# EAGLE design Backplane-2 (EAGLE 7.4.0)

## Sheet 1 of 2
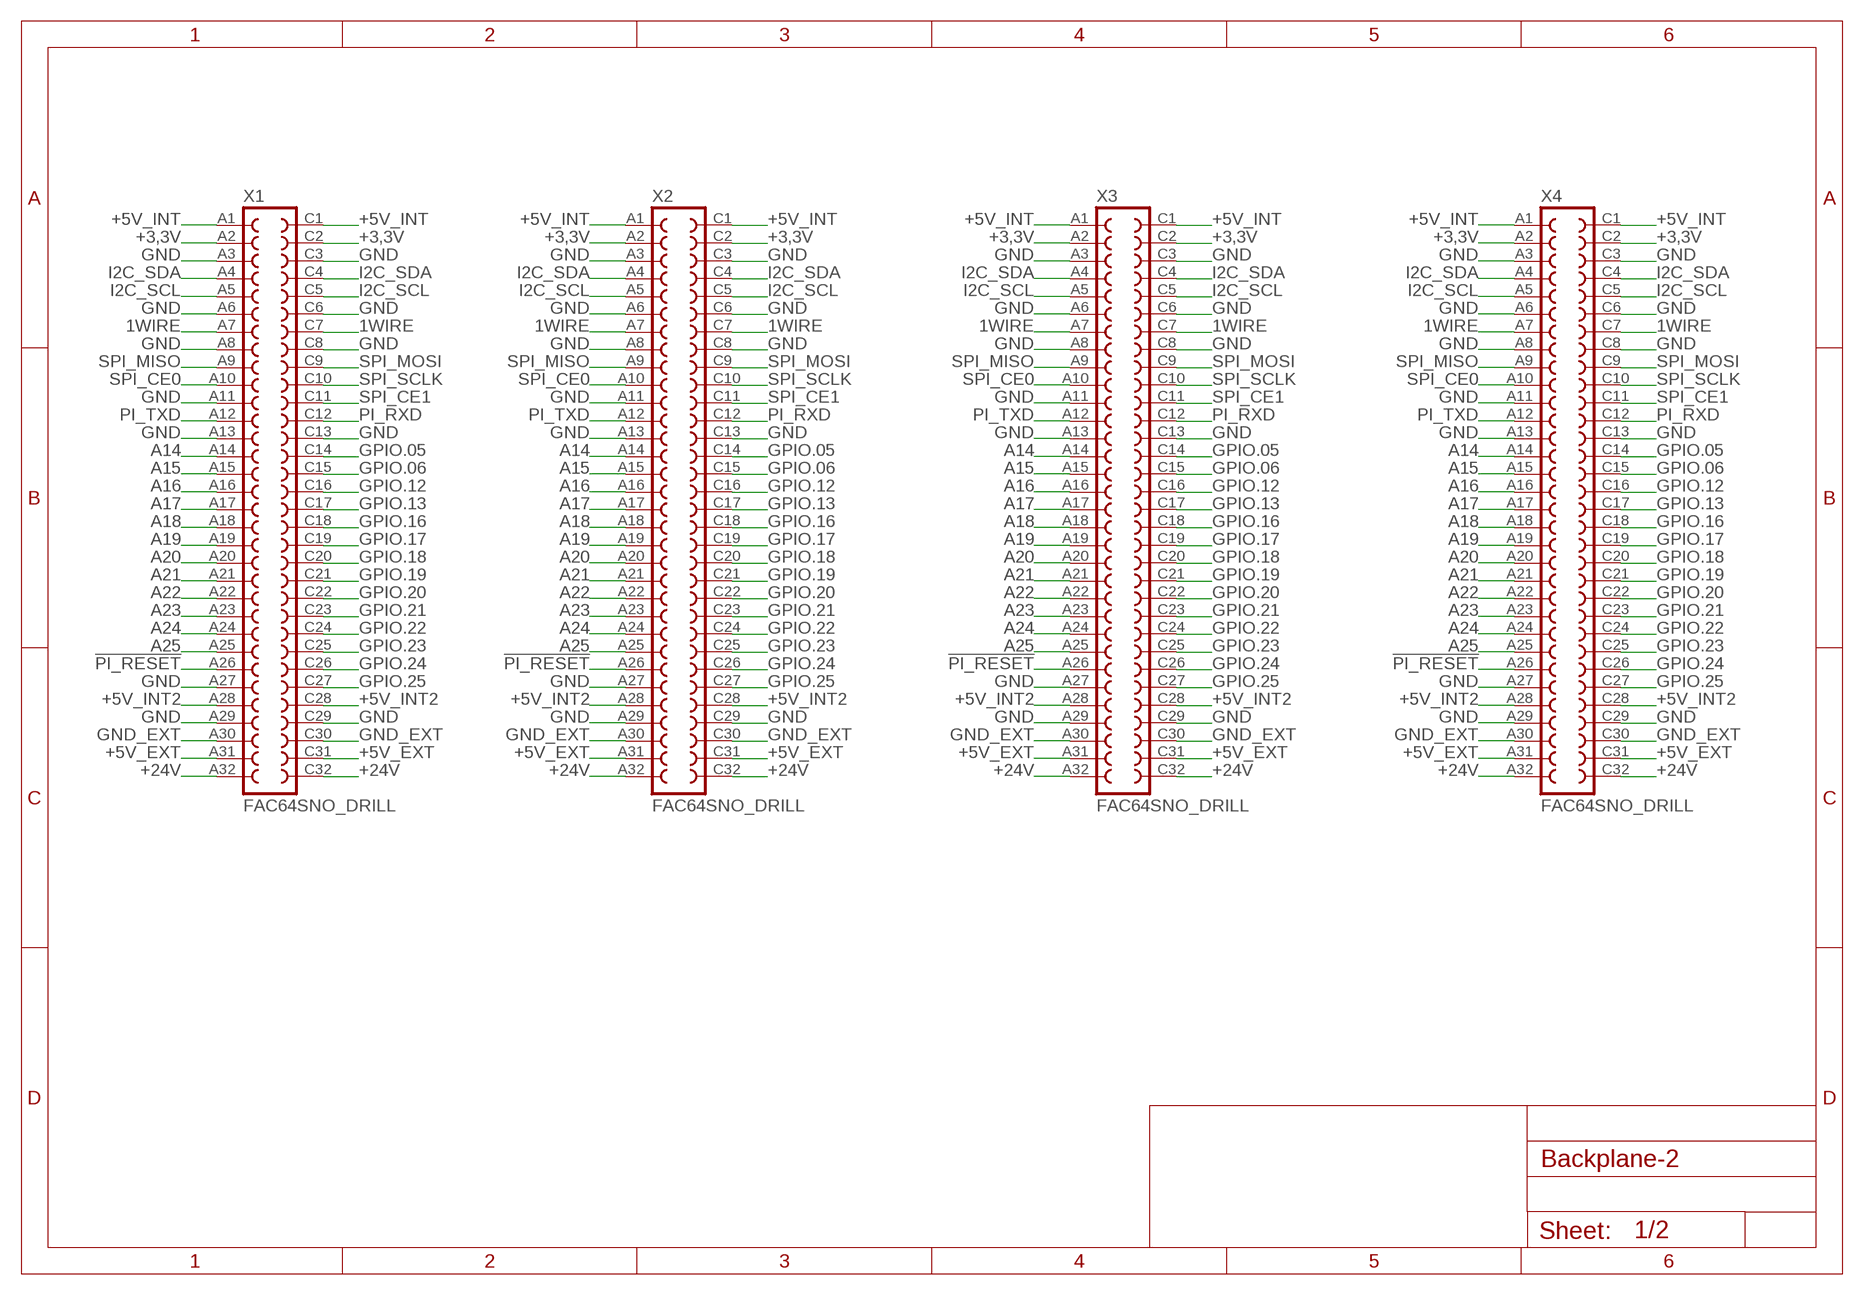
[diagram p0: schematic, sheet 1]

### Parts
X1  FAC64SNO_DRILL  [FAC64S_NO_DRILL]
X2  FAC64SNO_DRILL  [FAC64S_NO_DRILL]
X3  FAC64SNO_DRILL  [FAC64S_NO_DRILL]
X4  FAC64SNO_DRILL  [FAC64S_NO_DRILL]

### Nets
1WIRE: X1.A7 X1.C7 X2.A7 X2.C7 X3.A7 X3.C7 X4.A7 X4.C7 ; also sheet 2
!PI_RESET: X1.A26 X2.A26 X3.A26 X4.A26 ; also sheet 2
+3,3V: X1.A2 X1.C2 X2.A2 X2.C2 X3.A2 X3.C2 X4.A2 X4.C2 ; also sheet 2
+5V_EXT: X1.A31 X1.C31 X2.A31 X2.C31 X3.A31 X3.C31 X4.A31 X4.C31 ; also sheet 2
+5V_INT: X1.A1 X1.C1 X2.A1 X2.C1 X3.A1 X3.C1 X4.A1 X4.C1 ; also sheet 2
+5V_INT2: X1.A28 X1.C28 X2.A28 X2.C28 X3.A28 X3.C28 X4.A28 X4.C28 ; also sheet 2
+24V [24V]: X1.A32 X1.C32 X2.A32 X2.C32 X3.A32 X3.C32 X4.A32 X4.C32 ; also sheet 2
A14: X1.A14 X2.A14 X3.A14 X4.A14 ; also sheet 2
A15: X1.A15 X2.A15 X3.A15 X4.A15 ; also sheet 2
A16: X1.A16 X2.A16 X3.A16 X4.A16 ; also sheet 2
A17: X1.A17 X2.A17 X3.A17 X4.A17 ; also sheet 2
A18: X1.A18 X2.A18 X3.A18 X4.A18 ; also sheet 2
A19: X1.A19 X2.A19 X3.A19 X4.A19 ; also sheet 2
A20: X1.A20 X2.A20 X3.A20 X4.A20 ; also sheet 2
A21: X1.A21 X2.A21 X3.A21 X4.A21 ; also sheet 2
A22: X1.A22 X2.A22 X3.A22 X4.A22 ; also sheet 2
A23: X1.A23 X2.A23 X3.A23 X4.A23 ; also sheet 2
A24: X1.A24 X2.A24 X3.A24 X4.A24 ; also sheet 2
A25: X1.A25 X2.A25 X3.A25 X4.A25 ; also sheet 2
GND: X1.A3 X1.A6 X1.A8 X1.A11 X1.A13 X1.A27 X1.A29 X1.C3 X1.C6 X1.C8 X1.C13 X1.C29 X2.A3 X2.A6 X2.A8 X2.A11 X2.A13 X2.A27 X2.A29 X2.C3 X2.C6 X2.C8 X2.C13 X2.C29 X3.A3 X3.A6 X3.A8 X3.A11 X3.A13 X3.A27 X3.A29 X3.C3 X3.C6 X3.C8 X3.C13 X3.C29 X4.A3 X4.A6 X4.A8 X4.A11 X4.A13 X4.A27 X4.A29 X4.C3 X4.C6 X4.C8 X4.C13 X4.C29 ; also sheet 2
GND_EXT: X1.A30 X1.C30 X2.A30 X2.C30 X3.A30 X3.C30 X4.A30 X4.C30 ; also sheet 2
GPIO.05: X1.C14 X2.C14 X3.C14 X4.C14 ; also sheet 2
GPIO.06: X1.C15 X2.C15 X3.C15 X4.C15 ; also sheet 2
GPIO.12: X1.C16 X2.C16 X3.C16 X4.C16 ; also sheet 2
GPIO.13: X1.C17 X2.C17 X3.C17 X4.C17 ; also sheet 2
GPIO.16: X1.C18 X2.C18 X3.C18 X4.C18 ; also sheet 2
GPIO.17: X1.C19 X2.C19 X3.C19 X4.C19 ; also sheet 2
GPIO.18: X1.C20 X2.C20 X3.C20 X4.C20 ; also sheet 2
GPIO.19: X1.C21 X2.C21 X3.C21 X4.C21 ; also sheet 2
GPIO.20: X1.C22 X2.C22 X3.C22 X4.C22 ; also sheet 2
GPIO.21: X1.C23 X2.C23 X3.C23 X4.C23 ; also sheet 2
GPIO.22: X1.C24 X2.C24 X3.C24 X4.C24 ; also sheet 2
GPIO.23: X1.C25 X2.C25 X3.C25 X4.C25 ; also sheet 2
GPIO.24: X1.C26 X2.C26 X3.C26 X4.C26 ; also sheet 2
GPIO.25: X1.C27 X2.C27 X3.C27 X4.C27 ; also sheet 2
I2C_SCL: X1.A5 X1.C5 X2.A5 X2.C5 X3.A5 X3.C5 X4.A5 X4.C5 ; also sheet 2
I2C_SDA: X1.A4 X1.C4 X2.A4 X2.C4 X3.A4 X3.C4 X4.A4 X4.C4 ; also sheet 2
PI_RXD: X1.C12 X2.C12 X3.C12 X4.C12 ; also sheet 2
PI_TXD: X1.A12 X2.A12 X3.A12 X4.A12 ; also sheet 2
SPI_CE0: X1.A10 X2.A10 X3.A10 X4.A10 ; also sheet 2
SPI_CE1: X1.C11 X2.C11 X3.C11 X4.C11 ; also sheet 2
SPI_MISO: X1.A9 X2.A9 X3.A9 X4.A9 ; also sheet 2
SPI_MOSI: X1.C9 X2.C9 X3.C9 X4.C9 ; also sheet 2
SPI_SCLK: X1.C10 X2.C10 X3.C10 X4.C10 ; also sheet 2

## Sheet 2 of 2
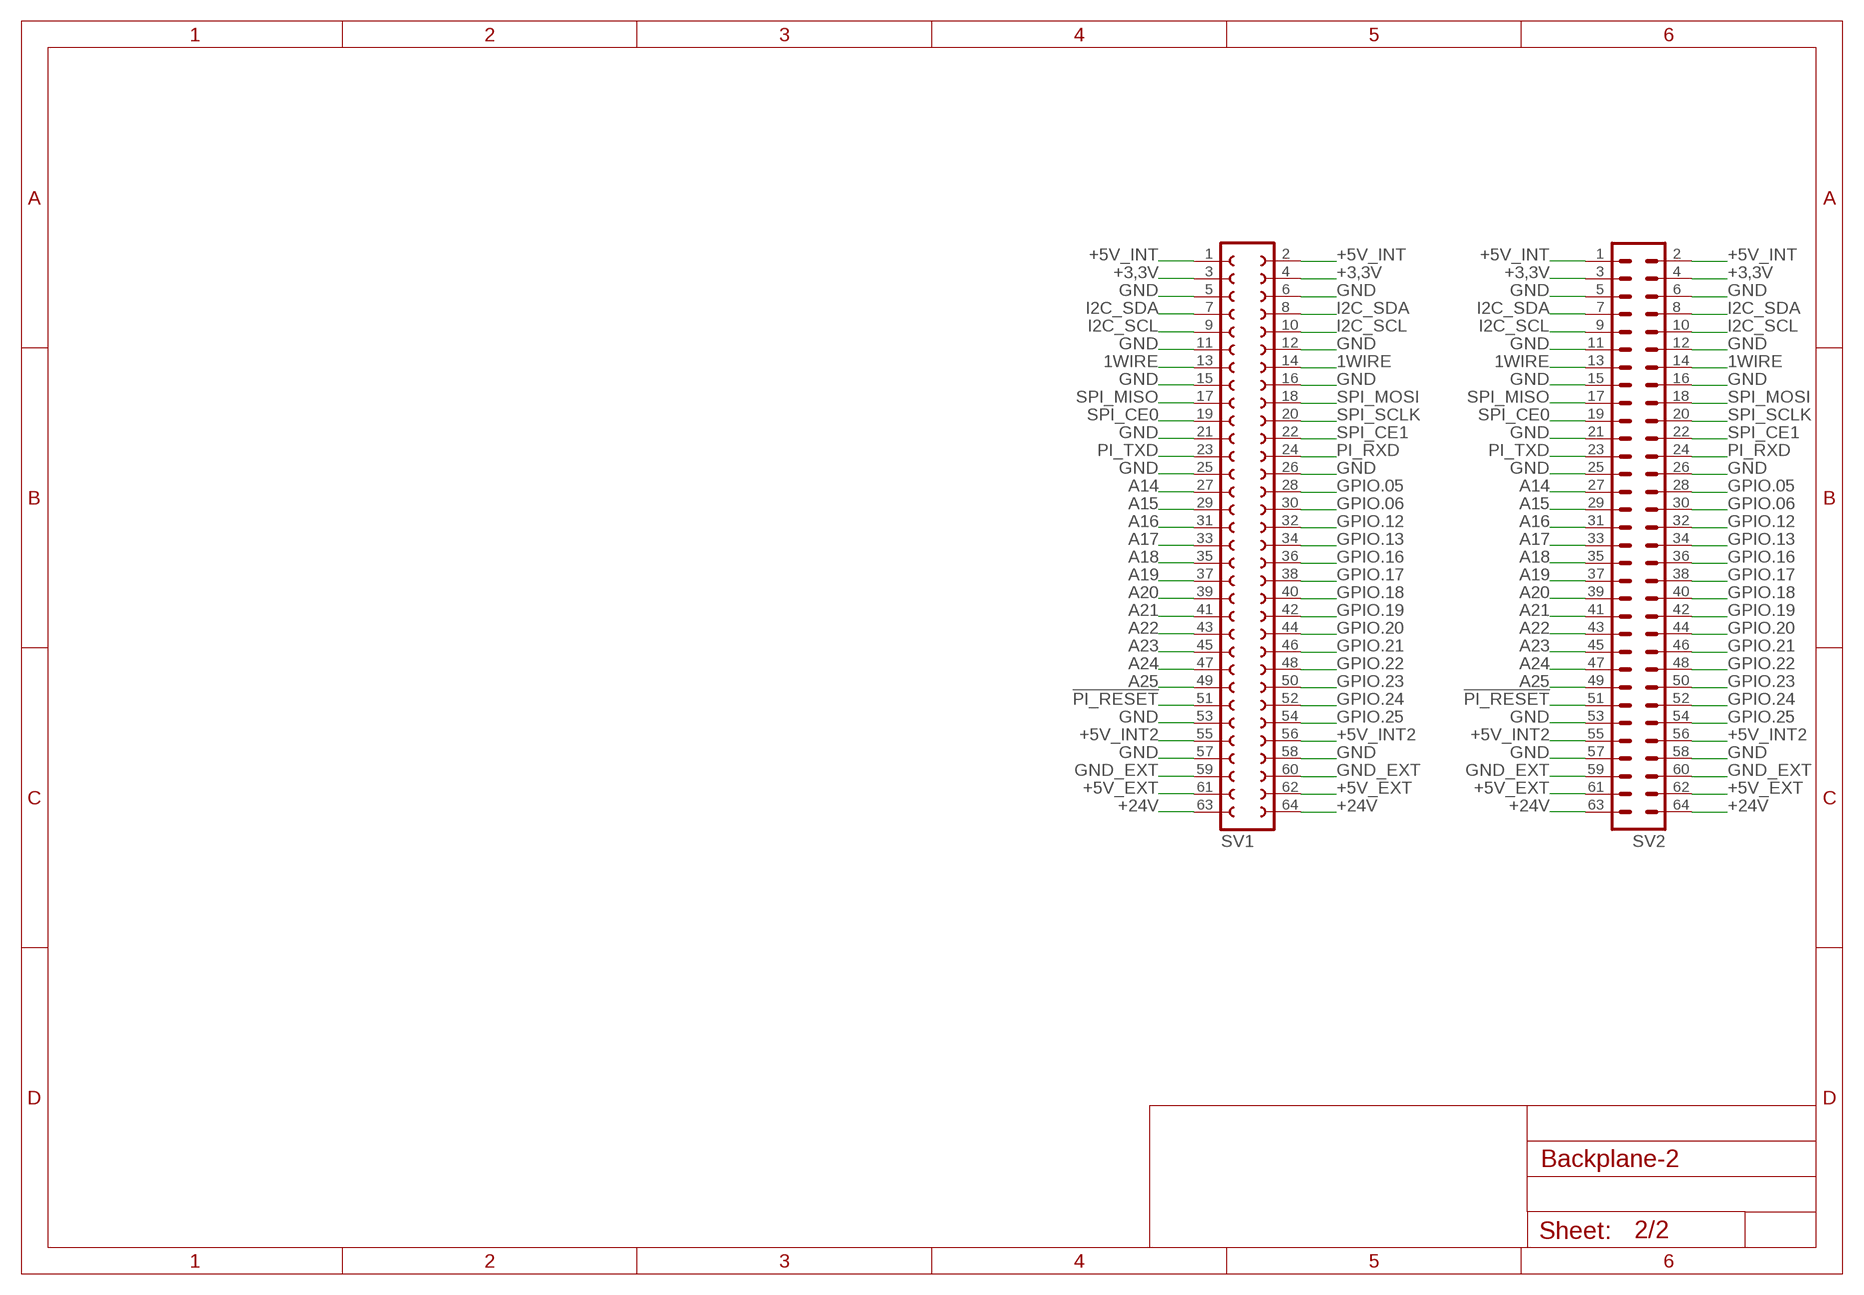
[diagram p1: schematic, sheet 2]

### Parts
SV1  FE32-2W  [FE32-2W]
SV2  MA32-2W  [MA32-2W]

### Nets
1WIRE: SV1.13 SV1.14 SV2.13 SV2.14 ; also sheet 1
!PI_RESET: SV1.51 SV2.51 ; also sheet 1
+3,3V: SV1.3 SV1.4 SV2.3 SV2.4 ; also sheet 1
+5V_EXT: SV1.61 SV1.62 SV2.61 SV2.62 ; also sheet 1
+5V_INT: SV1.1 SV1.2 SV2.1 SV2.2 ; also sheet 1
+5V_INT2: SV1.55 SV1.56 SV2.55 SV2.56 ; also sheet 1
+24V [24V]: SV1.63 SV1.64 SV2.63 SV2.64 ; also sheet 1
A14: SV1.27 SV2.27 ; also sheet 1
A15: SV1.29 SV2.29 ; also sheet 1
A16: SV1.31 SV2.31 ; also sheet 1
A17: SV1.33 SV2.33 ; also sheet 1
A18: SV1.35 SV2.35 ; also sheet 1
A19: SV1.37 SV2.37 ; also sheet 1
A20: SV1.39 SV2.39 ; also sheet 1
A21: SV1.41 SV2.41 ; also sheet 1
A22: SV1.43 SV2.43 ; also sheet 1
A23: SV1.45 SV2.45 ; also sheet 1
A24: SV1.47 SV2.47 ; also sheet 1
A25: SV1.49 SV2.49 ; also sheet 1
GND: SV1.5 SV1.6 SV1.11 SV1.12 SV1.15 SV1.16 SV1.21 SV1.25 SV1.26 SV1.53 SV1.57 SV1.58 SV2.5 SV2.6 SV2.11 SV2.12 SV2.15 SV2.16 SV2.21 SV2.25 SV2.26 SV2.53 SV2.57 SV2.58 ; also sheet 1
GND_EXT: SV1.59 SV1.60 SV2.59 SV2.60 ; also sheet 1
GPIO.05: SV1.28 SV2.28 ; also sheet 1
GPIO.06: SV1.30 SV2.30 ; also sheet 1
GPIO.12: SV1.32 SV2.32 ; also sheet 1
GPIO.13: SV1.34 SV2.34 ; also sheet 1
GPIO.16: SV1.36 SV2.36 ; also sheet 1
GPIO.17: SV1.38 SV2.38 ; also sheet 1
GPIO.18: SV1.40 SV2.40 ; also sheet 1
GPIO.19: SV1.42 SV2.42 ; also sheet 1
GPIO.20: SV1.44 SV2.44 ; also sheet 1
GPIO.21: SV1.46 SV2.46 ; also sheet 1
GPIO.22: SV1.48 SV2.48 ; also sheet 1
GPIO.23: SV1.50 SV2.50 ; also sheet 1
GPIO.24: SV1.52 SV2.52 ; also sheet 1
GPIO.25: SV1.54 SV2.54 ; also sheet 1
I2C_SCL: SV1.9 SV1.10 SV2.9 SV2.10 ; also sheet 1
I2C_SDA: SV1.7 SV1.8 SV2.7 SV2.8 ; also sheet 1
PI_RXD: SV1.24 SV2.24 ; also sheet 1
PI_TXD: SV1.23 SV2.23 ; also sheet 1
SPI_CE0: SV1.19 SV2.19 ; also sheet 1
SPI_CE1: SV1.22 SV2.22 ; also sheet 1
SPI_MISO: SV1.17 SV2.17 ; also sheet 1
SPI_MOSI: SV1.18 SV2.18 ; also sheet 1
SPI_SCLK: SV1.20 SV2.20 ; also sheet 1

## Library data of the parts
SV1 = 64-pol-verbinder:FE32-2W: FEMALE HEADER; OC_FARNELL: unknown; OC_NEWARK: unknown
SV2 = 64-pol-verbinder:MA32-2W: PIN HEADER; OC_FARNELL: unknown; OC_NEWARK: unknown
X1-X4 = my-con-vg:FAC64S: CONNECTOR female, 64 pins, block, type C, rows AC, grid 5.08 mm

## Net classes
1 24V: width 0.813 mm, clearance 0.406 mm

## Board
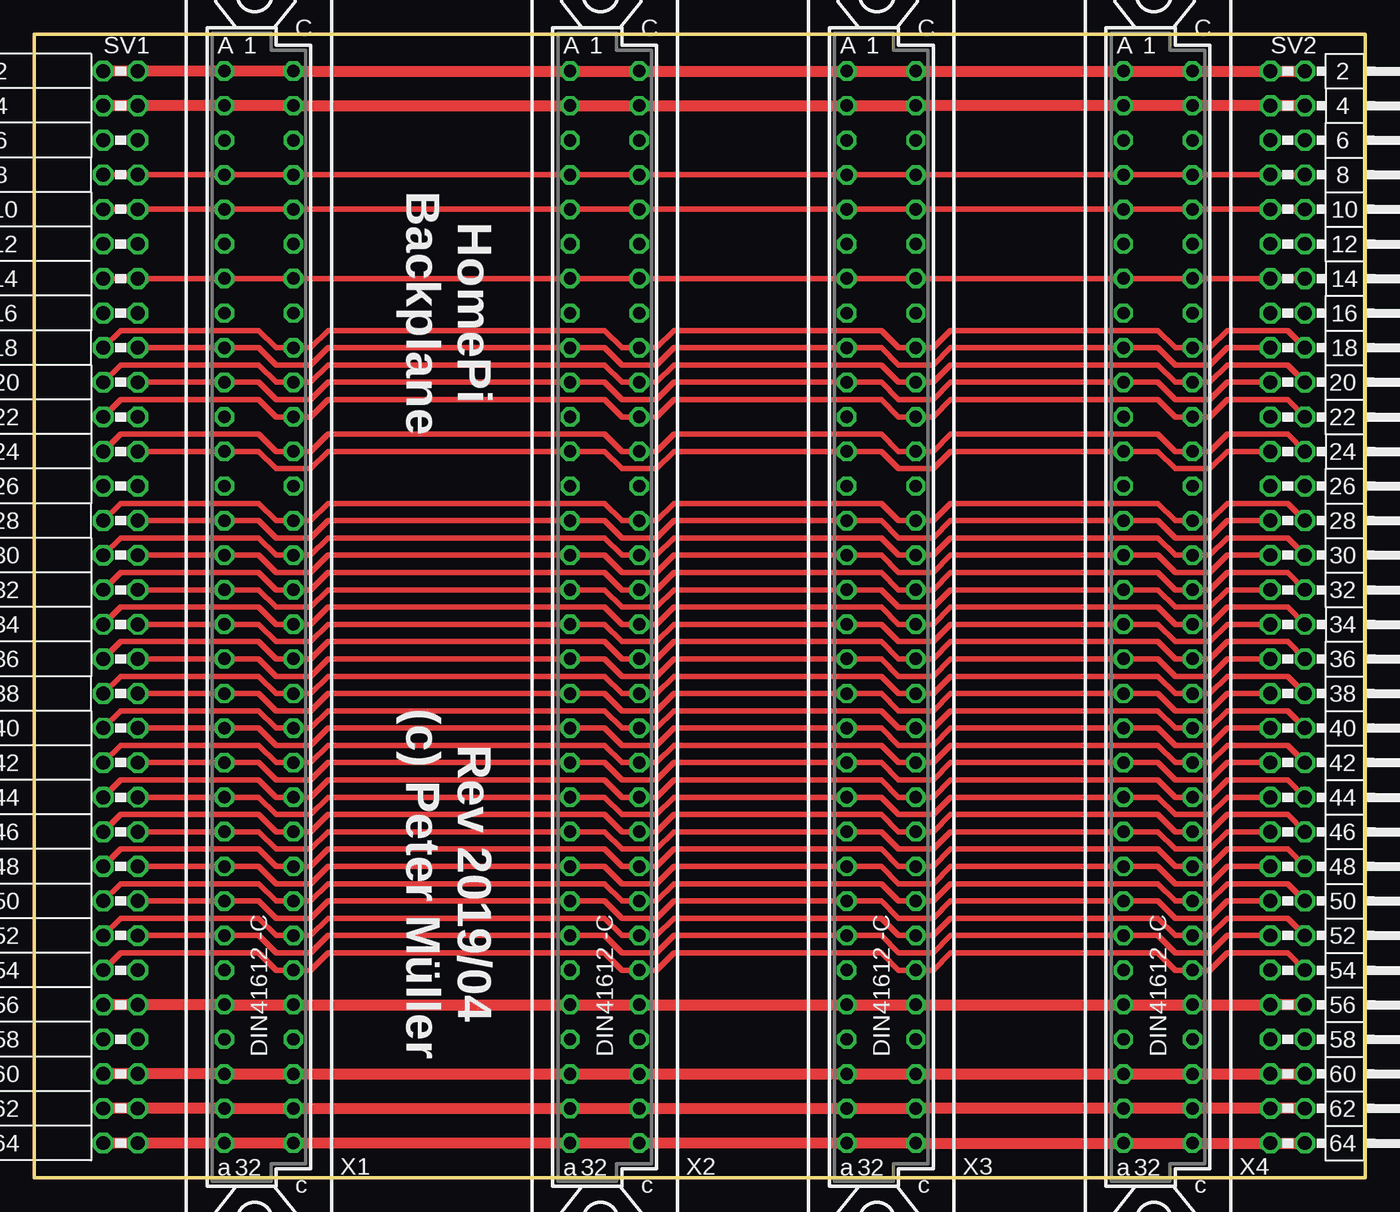
[diagram p2: board, top side]
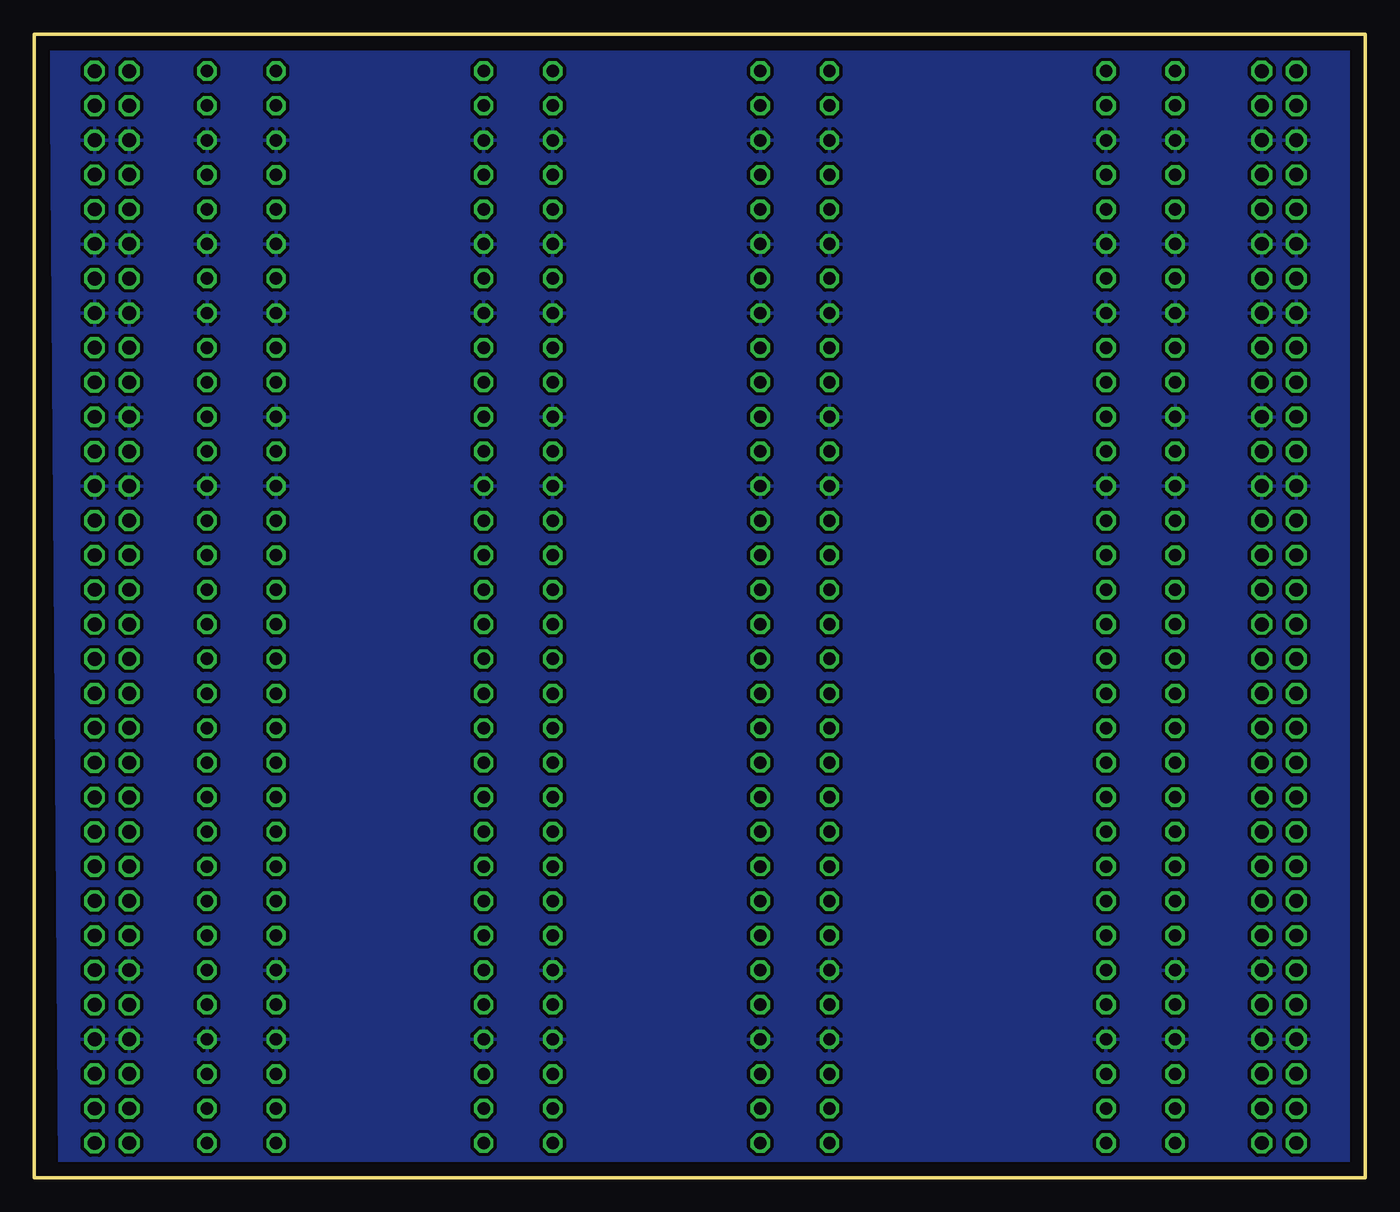
[diagram p3: board, bottom side, seen from below]

Size 97.79 x 84 mm. Coordinates in mm from the lower left corner, seen from the top.
Outline: 0,0 97.79,0 97.79,84 0,84 0,0
Copper layers (1*16): Top 0.035mm / dielectric 1.5mm / Bottom 0.035mm
Design rules "allpcb2": minimum track width 8mil, minimum drill 0.5mm, track to track 8mil, track to pad 8mil, pad to pad 8mil, via to via 8mil, smd to smd 6mil, copper to edge 40mil, drill to drill 8mil, minimum pad ring 10mil, minimum via ring 8mil, stop-mask expansion 0.1mm, vias tented up to drill 0mil, thermal gap 10mil

### Footprints (pad centres in the part's own frame; a part is rotated, then mirrored left to right if it is on the bottom)
FE32-2W = drill 1.016 octagon: 1 -36.83,1.27; 2 -36.83,-1.27; 3 -34.29,1.27; 4 -34.29,-1.27; 5 -31.75,1.27; 6 -31.75,-1.27; 7 -29.21,1.27; 8 -29.21,-1.27; 9 -26.67,1.27; 10 -26.67,-1.27; 11 -24.13,1.27; 12 -24.13,-1.27; 13 -21.59,1.27; 14 -21.59,-1.27; 15 -19.05,1.27; 16 -19.05,-1.27; 17 -16.51,1.27; 18 -16.51,-1.27; 19 -13.97,1.27; 20 -13.97,-1.27; 21 -11.43,1.27; 22 -11.43,-1.27; 23 -8.89,1.27; 24 -8.89,-1.27; 25 -6.35,1.27; 26 -6.35,-1.27; 27 -3.81,1.27; 28 -3.81,-1.27; 29 -1.27,1.27; 30 -1.27,-1.27; 31 1.27,1.27; 32 1.27,-1.27; 33 3.81,1.27; 34 3.81,-1.27; 35 6.35,1.27; 36 6.35,-1.27; 37 8.89,1.27; 38 8.89,-1.27; 39 11.43,1.27; 40 11.43,-1.27; 41 13.97,1.27; 42 13.97,-1.27; 43 16.51,1.27; 44 16.51,-1.27; 45 19.05,1.27; 46 19.05,-1.27; 47 21.59,1.27; 48 21.59,-1.27; 49 24.13,1.27; 50 24.13,-1.27; 51 26.67,1.27; 52 26.67,-1.27; 53 29.21,1.27; 54 29.21,-1.27; 55 31.75,1.27; 56 31.75,-1.27; 57 34.29,1.27; 58 34.29,-1.27; 59 36.83,1.27; 60 36.83,-1.27; 61 39.37,1.27; 62 39.37,-1.27; 63 41.91,1.27; 64 41.91,-1.27
MA32-2W = drill 1.016 octagon: 1 -36.83,-1.27; 2 -36.83,1.27; 3 -34.29,-1.27; 4 -34.29,1.27; 5 -31.75,-1.27; 6 -31.75,1.27; 7 -29.21,-1.27; 8 -29.21,1.27; 9 -26.67,-1.27; 10 -26.67,1.27; 11 -24.13,-1.27; 12 -24.13,1.27; 13 -21.59,-1.27; 14 -21.59,1.27; 15 -19.05,-1.27; 16 -19.05,1.27; 17 -16.51,-1.27; 18 -16.51,1.27; 19 -13.97,-1.27; 20 -13.97,1.27; 21 -11.43,-1.27; 22 -11.43,1.27; 23 -8.89,-1.27; 24 -8.89,1.27; 25 -6.35,-1.27; 26 -6.35,1.27; 27 -3.81,-1.27; 28 -3.81,1.27; 29 -1.27,-1.27; 30 -1.27,1.27; 31 1.27,-1.27; 32 1.27,1.27; 33 3.81,-1.27; 34 3.81,1.27; 35 6.35,-1.27; 36 6.35,1.27; 37 8.89,-1.27; 38 8.89,1.27; 39 11.43,-1.27; 40 11.43,1.27; 41 13.97,-1.27; 42 13.97,1.27; 43 16.51,-1.27; 44 16.51,1.27; 45 19.05,-1.27; 46 19.05,1.27; 47 21.59,-1.27; 48 21.59,1.27; 49 24.13,-1.27; 50 24.13,1.27; 51 26.67,-1.27; 52 26.67,1.27; 53 29.21,-1.27; 54 29.21,1.27; 55 31.75,-1.27; 56 31.75,1.27; 57 34.29,-1.27; 58 34.29,1.27; 59 36.83,-1.27; 60 36.83,1.27; 61 39.37,-1.27; 62 39.37,1.27; 63 41.91,-1.27; 64 41.91,1.27
FAC64S_NO_DRILL = drill 0.914 octagon: A1 -2.54,39.37; A2 -2.54,36.83; A3 -2.54,34.29; A4 -2.54,31.75; A5 -2.54,29.21; A6 -2.54,26.67; A7 -2.54,24.13; A8 -2.54,21.59; A9 -2.54,19.05; A10 -2.54,16.51; A11 -2.54,13.97; A12 -2.54,11.43; A13 -2.54,8.89; A14 -2.54,6.35; A15 -2.54,3.81; A16 -2.54,1.27; A17 -2.54,-1.27; A18 -2.54,-3.81; A19 -2.54,-6.35; A20 -2.54,-8.89; A21 -2.54,-11.43; A22 -2.54,-13.97; A23 -2.54,-16.51; A24 -2.54,-19.05; A25 -2.54,-21.59; A26 -2.54,-24.13; A27 -2.54,-26.67; A28 -2.54,-29.21; A29 -2.54,-31.75; A30 -2.54,-34.29; A31 -2.54,-36.83; A32 -2.54,-39.37; C1 2.54,39.37; C2 2.54,36.83; C3 2.54,34.29; C4 2.54,31.75; C5 2.54,29.21; C6 2.54,26.67; C7 2.54,24.13; C8 2.54,21.59; C9 2.54,19.05; C10 2.54,16.51; C11 2.54,13.97; C12 2.54,11.43; C13 2.54,8.89; C14 2.54,6.35; C15 2.54,3.81; C16 2.54,1.27; C17 2.54,-1.27; C18 2.54,-3.81; C19 2.54,-6.35; C20 2.54,-8.89; C21 2.54,-11.43; C22 2.54,-13.97; C23 2.54,-16.51; C24 2.54,-19.05; C25 2.54,-21.59; C26 2.54,-24.13; C27 2.54,-26.67; C28 2.54,-29.21; C29 2.54,-31.75; C30 2.54,-34.29; C31 2.54,-36.83; C32 2.54,-39.37

### Placement (x,y rotation side)
SV1  6.35,44.45 270 top
SV2  92.08,44.45 270 top
X1  16.51,41.91 0 top
X2  41.91,41.91 0 top
X3  62.23,41.91 0 top
X4  82.55,41.91 0 top

### Tracks (layer width: path | path; a pad name or v marks a point on that pad's centre or on a via)
1WIRE
  Top 0.406: SV1.14 SV1.13 X1.A7 X1.C7 X2.A7 X2.C7 X3.A7 X3.C7 X4.A7 X4.C7 SV2.13 SV2.14
!PI_RESET
  Top 0.406: SV1.51 X1.A26 16.51,17.78 17.78,16.51 20.32,16.51 21.59,17.78 X2.A26 41.91,17.78 43.18,16.51 45.72,16.51 46.99,17.78 X3.A26 62.23,17.78 63.5,16.51 66.04,16.51 67.31,17.78 X4.A26 82.55,17.78 83.82,16.51 86.36,16.51 87.63,17.78 SV2.51
+3,3V
  Top 0.813: SV1.4 SV1.3 X1.A2 X1.C2 X2.A2 X2.C2 X3.A2 X3.C2 X4.A2 X4.C2 SV2.3 SV2.4
+5V_EXT
  Top 0.813: SV1.62 SV1.61 X1.A31 X1.C31 X2.A31 X2.C31 X3.A31 X3.C31 X4.A31 X4.C31 SV2.61 SV2.62
+5V_INT
  Top 0.813: SV1.2 SV1.1 X1.A1 X1.C1 X2.A1 X2.C1 X3.A1 X3.C1 X4.A1 X4.C1 SV2.1 SV2.2
+5V_INT2
  Top 0.813: SV1.56 SV1.55 X1.A28 X1.C28 X2.A28 X2.C28 X3.A28 X3.C28 X4.A28 X4.C28 SV2.55 SV2.56
+24V
  Top 0.813: SV1.64 SV1.63 X1.A32 X1.C32 X2.A32 X2.C32 X3.A32 X3.C32 X4.A32 X4.C32 SV2.63 SV2.64
A14
  Top 0.406: SV1.27 X1.A14 16.51,48.26 17.78,46.99 20.32,46.99 21.59,48.26 X2.A14 41.91,48.26 43.18,46.99 45.72,46.99 46.99,48.26 X3.A14 62.23,48.26 63.5,46.99 66.04,46.99 67.31,48.26 X4.A14 82.55,48.26 83.82,46.99 86.36,46.99 87.63,48.26 SV2.27
A15
  Top 0.406: SV1.29 X1.A15 16.51,45.72 17.78,44.45 20.32,44.45 21.59,45.72 X2.A15 41.91,45.72 43.18,44.45 45.72,44.45 46.99,45.72 X3.A15 62.23,45.72 63.5,44.45 66.04,44.45 67.31,45.72 X4.A15 82.55,45.72 83.82,44.45 86.36,44.45 87.63,45.72 SV2.29
A16
  Top 0.406: SV1.31 X1.A16 16.51,43.18 17.78,41.91 20.32,41.91 21.59,43.18 X2.A16 41.91,43.18 43.18,41.91 45.72,41.91 46.99,43.18 X3.A16 62.23,43.18 63.5,41.91 66.04,41.91 67.31,43.18 X4.A16 82.55,43.18 83.82,41.91 86.36,41.91 87.63,43.18 SV2.31
A17
  Top 0.406: SV1.33 X1.A17 16.51,40.64 17.78,39.37 20.32,39.37 21.59,40.64 X2.A17 41.91,40.64 43.18,39.37 45.72,39.37 46.99,40.64 X3.A17 62.23,40.64 63.5,39.37 66.04,39.37 67.31,40.64 X4.A17 82.55,40.64 83.82,39.37 86.36,39.37 87.63,40.64 SV2.33
A18
  Top 0.406: SV1.35 X1.A18 16.51,38.1 17.78,36.83 20.32,36.83 21.59,38.1 X2.A18 41.91,38.1 43.18,36.83 45.72,36.83 46.99,38.1 X3.A18 62.23,38.1 63.5,36.83 66.04,36.83 67.31,38.1 X4.A18 82.55,38.1 83.82,36.83 86.36,36.83 87.63,38.1 SV2.35
A19
  Top 0.406: SV1.37 X1.A19 16.51,35.56 17.78,34.29 20.32,34.29 21.59,35.56 X2.A19 41.91,35.56 43.18,34.29 45.72,34.29 46.99,35.56 X3.A19 62.23,35.56 63.5,34.29 66.04,34.29 67.31,35.56 X4.A19 82.55,35.56 83.82,34.29 86.36,34.29 87.63,35.56 SV2.37
A20
  Top 0.406: SV1.39 X1.A20 16.51,33.02 17.78,31.75 20.32,31.75 21.59,33.02 X2.A20 41.91,33.02 43.18,31.75 45.72,31.75 46.99,33.02 X3.A20 62.23,33.02 63.5,31.75 66.04,31.75 67.31,33.02 X4.A20 82.55,33.02 83.82,31.75 86.36,31.75 87.63,33.02 SV2.39
A21
  Top 0.406: SV1.41 X1.A21 16.51,30.48 17.78,29.21 20.32,29.21 21.59,30.48 X2.A21 41.91,30.48 43.18,29.21 45.72,29.21 46.99,30.48 X3.A21 62.23,30.48 63.5,29.21 66.04,29.21 67.31,30.48 X4.A21 82.55,30.48 83.82,29.21 86.36,29.21 87.63,30.48 SV2.41
A22
  Top 0.406: SV1.43 X1.A22 16.51,27.94 17.78,26.67 20.32,26.67 21.59,27.94 X2.A22 41.91,27.94 43.18,26.67 45.72,26.67 46.99,27.94 X3.A22 62.23,27.94 63.5,26.67 66.04,26.67 67.31,27.94 X4.A22 82.55,27.94 83.82,26.67 86.36,26.67 87.63,27.94 SV2.43
A23
  Top 0.406: SV1.45 X1.A23 16.51,25.4 17.78,24.13 20.32,24.13 21.59,25.4 X2.A23 41.91,25.4 43.18,24.13 45.72,24.13 46.99,25.4 X3.A23 62.23,25.4 63.5,24.13 66.04,24.13 67.31,25.4 X4.A23 82.55,25.4 83.82,24.13 86.36,24.13 87.63,25.4 SV2.45
A24
  Top 0.406: SV1.47 X1.A24 16.51,22.86 17.78,21.59 20.32,21.59 21.59,22.86 X2.A24 41.91,22.86 43.18,21.59 45.72,21.59 46.99,22.86 X3.A24 62.23,22.86 63.5,21.59 66.04,21.59 67.31,22.86 X4.A24 82.55,22.86 83.82,21.59 86.36,21.59 87.63,22.86 SV2.47
A25
  Top 0.406: SV1.49 X1.A25 16.51,20.32 17.78,19.05 20.32,19.05 21.59,20.32 X2.A25 41.91,20.32 43.18,19.05 45.72,19.05 46.99,20.32 X3.A25 62.23,20.32 63.5,19.05 66.04,19.05 67.31,20.32 X4.A25 82.55,20.32 83.82,19.05 86.36,19.05 87.63,20.32 SV2.49
GND
  pour Bottom (isolate 0.254): 1.27,83.19 96.52,83.19 95.89,0.64 1.27,0.64
GND_EXT
  Top 0.813: SV1.60 SV1.59 X1.A30 X1.C30 X2.A30 X2.C30 X3.A30 X3.C30 X4.A30 X4.C30 SV2.59 SV2.60
GPIO.05
  Top 0.406: SV1.28 6.35,49.53 16.51,49.53 17.78,48.26 X1.C14 20.32,48.26 21.59,49.53 41.91,49.53 43.18,48.26 X2.C14 45.72,48.26 46.99,49.53 62.23,49.53 63.5,48.26 X3.C14 66.04,48.26 67.31,49.53 82.55,49.53 83.82,48.26 X4.C14 86.36,48.26 87.63,49.53 92.08,49.53 SV2.28
GPIO.06
  Top 0.406: SV1.30 6.35,46.99 16.51,46.99 17.78,45.72 X1.C15 20.32,45.72 21.59,46.99 41.91,46.99 43.18,45.72 X2.C15 45.72,45.72 46.99,46.99 62.23,46.99 63.5,45.72 X3.C15 66.04,45.72 67.31,46.99 82.55,46.99 83.82,45.72 X4.C15 86.36,45.72 87.63,46.99 92.08,46.99 SV2.30
GPIO.12
  Top 0.406: SV1.32 6.35,44.45 16.51,44.45 17.78,43.18 X1.C16 20.32,43.18 21.59,44.45 41.91,44.45 43.18,43.18 X2.C16 45.72,43.18 46.99,44.45 62.23,44.45 63.5,43.18 X3.C16 66.04,43.18 67.31,44.45 82.55,44.45 83.82,43.18 X4.C16 86.36,43.18 87.63,44.45 92.08,44.45 SV2.32
GPIO.13
  Top 0.406: SV1.34 6.35,41.91 16.51,41.91 17.78,40.64 X1.C17 20.32,40.64 21.59,41.91 41.91,41.91 43.18,40.64 X2.C17 45.72,40.64 46.99,41.91 62.23,41.91 63.5,40.64 X3.C17 66.04,40.64 67.31,41.91 82.55,41.91 83.82,40.64 X4.C17 86.36,40.64 87.63,41.91 92.08,41.91 SV2.34
GPIO.16
  Top 0.406: SV1.36 6.35,39.37 16.51,39.37 17.78,38.1 X1.C18 20.32,38.1 21.59,39.37 41.91,39.37 43.18,38.1 X2.C18 45.72,38.1 46.99,39.37 62.23,39.37 63.5,38.1 X3.C18 66.04,38.1 67.31,39.37 82.55,39.37 83.82,38.1 X4.C18 86.36,38.1 87.63,39.37 92.08,39.37 SV2.36
GPIO.17
  Top 0.406: SV1.38 6.35,36.83 16.51,36.83 17.78,35.56 X1.C19 20.32,35.56 21.59,36.83 41.91,36.83 43.18,35.56 X2.C19 45.72,35.56 46.99,36.83 62.23,36.83 63.5,35.56 X3.C19 66.04,35.56 67.31,36.83 82.55,36.83 83.82,35.56 X4.C19 86.36,35.56 87.63,36.83 92.08,36.83 SV2.38
GPIO.18
  Top 0.406: SV1.40 6.35,34.29 16.51,34.29 17.78,33.02 X1.C20 20.32,33.02 21.59,34.29 41.91,34.29 43.18,33.02 X2.C20 45.72,33.02 46.99,34.29 62.23,34.29 63.5,33.02 X3.C20 66.04,33.02 67.31,34.29 82.55,34.29 83.82,33.02 X4.C20 86.36,33.02 87.63,34.29 92.08,34.29 SV2.40
GPIO.19
  Top 0.406: SV1.42 6.35,31.75 16.51,31.75 17.78,30.48 X1.C21 20.32,30.48 21.59,31.75 41.91,31.75 43.18,30.48 X2.C21 45.72,30.48 46.99,31.75 62.23,31.75 63.5,30.48 X3.C21 66.04,30.48 67.31,31.75 82.55,31.75 83.82,30.48 X4.C21 86.36,30.48 87.63,31.75 92.08,31.75 SV2.42
GPIO.20
  Top 0.406: SV1.44 6.35,29.21 16.51,29.21 17.78,27.94 X1.C22 20.32,27.94 21.59,29.21 41.91,29.21 43.18,27.94 X2.C22 45.72,27.94 46.99,29.21 62.23,29.21 63.5,27.94 X3.C22 66.04,27.94 67.31,29.21 82.55,29.21 83.82,27.94 X4.C22 86.36,27.94 87.63,29.21 92.08,29.21 SV2.44
GPIO.21
  Top 0.406: SV1.46 6.35,26.67 16.51,26.67 17.78,25.4 X1.C23 20.32,25.4 21.59,26.67 41.91,26.67 43.18,25.4 X2.C23 45.72,25.4 46.99,26.67 62.23,26.67 63.5,25.4 X3.C23 66.04,25.4 67.31,26.67 82.55,26.67 83.82,25.4 X4.C23 86.36,25.4 87.63,26.67 92.08,26.67 SV2.46
GPIO.22
  Top 0.406: SV1.48 6.35,24.13 16.51,24.13 17.78,22.86 X1.C24 20.32,22.86 21.59,24.13 41.91,24.13 43.18,22.86 X2.C24 45.72,22.86 46.99,24.13 62.23,24.13 63.5,22.86 X3.C24 66.04,22.86 67.31,24.13 82.55,24.13 83.82,22.86 X4.C24 86.36,22.86 87.63,24.13 92.08,24.13 SV2.48
GPIO.23
  Top 0.406: SV1.50 6.35,21.59 16.51,21.59 17.78,20.32 X1.C25 20.32,20.32 21.59,21.59 41.91,21.59 43.18,20.32 X2.C25 45.72,20.32 46.99,21.59 62.23,21.59 63.5,20.32 X3.C25 66.04,20.32 67.31,21.59 82.55,21.59 83.82,20.32 X4.C25 86.36,20.32 87.63,21.59 92.08,21.59 SV2.50
GPIO.24
  Top 0.406: SV1.52 6.35,19.05 16.51,19.05 17.78,17.78 X1.C26 20.32,17.78 21.59,19.05 41.91,19.05 43.18,17.78 X2.C26 45.72,17.78 46.99,19.05 62.23,19.05 63.5,17.78 X3.C26 66.04,17.78 67.31,19.05 82.55,19.05 83.82,17.78 X4.C26 86.36,17.78 87.63,19.05 92.08,19.05 SV2.52
GPIO.25
  Top 0.406: SV1.54 6.35,16.51 16.51,16.51 17.78,15.24 X1.C27 20.32,15.24 21.59,16.51 41.91,16.51 43.18,15.24 X2.C27 45.72,15.24 46.99,16.51 62.23,16.51 63.5,15.24 X3.C27 66.04,15.24 67.31,16.51 82.55,16.51 83.82,15.24 X4.C27 86.36,15.24 87.63,16.51 92.08,16.51 SV2.54
I2C_SCL
  Top 0.406: SV1.10 SV1.9 X1.A5 X1.C5 X2.A5 X2.C5 X3.A5 X3.C5 X4.A5 X4.C5 SV2.9 SV2.10
I2C_SDA
  Top 0.406: SV1.8 SV1.7 X1.A4 X1.C4 X2.A4 X2.C4 X3.A4 X3.C4 X4.A4 X4.C4 SV2.7 SV2.8
PI_RXD
  Top 0.406: SV1.24 6.35,54.61 16.51,54.61 17.78,53.34 X1.C12 20.32,53.34 21.59,54.61 41.91,54.61 43.18,53.34 X2.C12 45.72,53.34 46.99,54.61 62.23,54.61 63.5,53.34 X3.C12 66.04,53.34 67.31,54.61 82.55,54.61 83.82,53.34 X4.C12 86.36,53.34 87.63,54.61 92.08,54.61 SV2.24
PI_TXD
  Top 0.406: SV1.23 X1.A12 16.51,53.34 17.78,52.07 20.32,52.07 21.59,53.34 X2.A12 41.91,53.34 43.18,52.07 45.72,52.07 46.99,53.34 X3.A12 62.23,53.34 63.5,52.07 66.04,52.07 67.31,53.34 X4.A12 82.55,53.34 83.82,52.07 86.36,52.07 87.63,53.34 SV2.23
SPI_CE0
  Top 0.406: SV1.19 X1.A10 16.51,58.42 17.78,57.15 20.32,57.15 21.59,58.42 X2.A10 41.91,58.42 43.18,57.15 45.72,57.15 46.99,58.42 X3.A10 62.23,58.42 63.5,57.15 66.04,57.15 67.31,58.42 X4.A10 82.55,58.42 83.82,57.15 86.36,57.15 87.63,58.42 SV2.19
SPI_CE1
  Top 0.406: SV1.22 6.35,57.15 16.51,57.15 17.78,55.88 X1.C11 20.32,55.88 21.59,57.15 41.91,57.15 43.18,55.88 X2.C11 45.72,55.88 46.99,57.15 62.23,57.15 63.5,55.88 X3.C11 66.04,55.88 67.31,57.15 82.55,57.15 83.82,55.88 X4.C11 86.36,55.88 87.63,57.15 92.08,57.15 SV2.22
SPI_MISO
  Top 0.406: SV1.17 X1.A9 16.51,60.96 17.78,59.69 20.32,59.69 21.59,60.96 X2.A9 41.91,60.96 43.18,59.69 45.72,59.69 46.99,60.96 X3.A9 62.23,60.96 63.5,59.69 66.04,59.69 67.31,60.96 X4.A9 82.55,60.96 83.82,59.69 86.36,59.69 87.63,60.96 SV2.17
SPI_MOSI
  Top 0.406: SV1.18 6.35,62.23 16.51,62.23 17.78,60.96 X1.C9 20.32,60.96 21.59,62.23 41.91,62.23 43.18,60.96 X2.C9 45.72,60.96 46.99,62.23 62.23,62.23 63.5,60.96 X3.C9 66.04,60.96 67.31,62.23 82.55,62.23 83.82,60.96 X4.C9 86.36,60.96 87.63,62.23 92.08,62.23 SV2.18
SPI_SCLK
  Top 0.406: SV1.20 6.35,59.69 16.51,59.69 17.78,58.42 X1.C10 20.32,58.42 21.59,59.69 41.91,59.69 43.18,58.42 X2.C10 45.72,58.42 46.99,59.69 62.23,59.69 63.5,58.42 X3.C10 66.04,58.42 67.31,59.69 82.55,59.69 83.82,58.42 X4.C10 86.36,58.42 87.63,59.69 92.08,59.69 SV2.20

### Text on the board
tNames: HomePi / Backplane | Rev 2019/04 / (c) Peter Müller